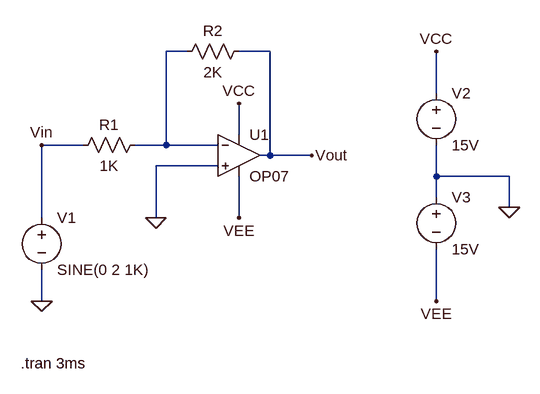
[diagram p0: schematic inverting amplifier.asc]
inverting amplifier.asc, the LTspice schematic file:
Version 4
SHEET 1 880 680
WIRE 128 0 96 0
WIRE 256 0 208 0
WIRE 512 64 512 0
WIRE 208 128 208 80
WIRE -32 144 -96 144
WIRE 96 144 96 0
WIRE 96 144 48 144
WIRE 176 144 96 144
WIRE 256 160 256 0
WIRE 256 160 240 160
WIRE 320 160 256 160
WIRE 176 176 80 176
WIRE 512 192 512 144
WIRE 624 192 512 192
WIRE 512 224 512 192
WIRE 624 240 624 192
WIRE -96 256 -96 144
WIRE 80 256 80 176
WIRE 208 256 208 192
WIRE -96 384 -96 336
WIRE 512 384 512 304
FLAG 80 256 0
FLAG -96 384 0
FLAG 624 240 0
FLAG 208 80 VCC
FLAG 208 256 VEE
FLAG 512 384 VEE
FLAG 512 0 VCC
FLAG -96 144 Vin
FLAG 320 160 Vout
SYMBOL OpAmps\\OP07 208 96 R0
SYMATTR InstName U1
SYMBOL res 64 128 R90
WINDOW 0 0 56 VBottom 2
WINDOW 3 32 56 VTop 2
SYMATTR InstName R1
SYMATTR Value 1K
SYMBOL res 224 -16 R90
WINDOW 0 0 56 VBottom 2
WINDOW 3 32 56 VTop 2
SYMATTR InstName R2
SYMATTR Value 2K
SYMBOL voltage -96 240 R0
WINDOW 123 0 0 Left 0
WINDOW 39 0 0 Left 0
SYMATTR InstName V1
SYMATTR Value SINE(0 2 1K)
SYMBOL voltage 512 48 R0
WINDOW 123 0 0 Left 0
WINDOW 39 0 0 Left 0
SYMATTR InstName V2
SYMATTR Value 15V
SYMBOL voltage 512 208 R0
WINDOW 123 0 0 Left 0
WINDOW 39 0 0 Left 0
SYMATTR InstName V3
SYMATTR Value 15V
TEXT -128 480 Left 2 !.tran 3ms

The netlist it stands for:
* inverting amplifier.asc
XU1 0 N001 VCC VEE Vout LT1001  ; OP07, pins In+ In- V+ V- OUT
R1 N001 Vin 1K
R2 Vout N001 2K
V1 Vin 0 SINE(0 2 1K)
V2 VCC 0 15V
V3 0 VEE 15V
.tran 3ms
.lib LTC.lib
.backanno
.end